# EAGLE schematic LM117_LDO_module (EAGLE 9.6.2)
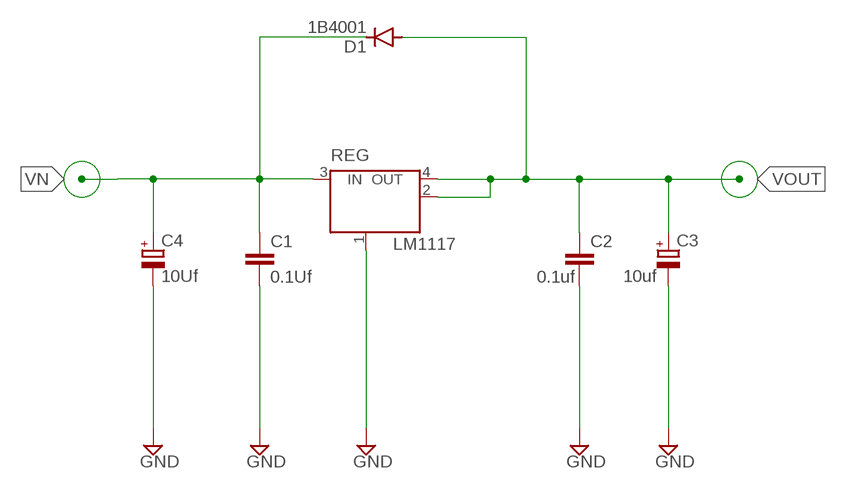
[diagram p0: schematic, sheet 1]

## Parts
C1  0.1Uf  C-EUC1206  [C1206]
C2  0.1uf  C-EUC1206  [C1206]
C3  10uf  CPOL-EUCT3216  [CT3216]
C4  10Uf  CPOL-EUCT3216  [CT3216]
D1  1B4001  DIODE-DO-214AC  [DO-214AC]
REG  LM1117  MC33269ST-3.3T3  [SOT223]

## Nets
GND: C1.2 C2.2 C3.- C4.- REG.1(GND/ADJ)
VN: C1.1 C4.+ D1.C REG.3(IN)
VOUT: C2.1 C3.+ D1.A REG.2(OUT) REG.4(OUT)

## Library data of the parts
C1 C2 = rcl:C-EU: CAPACITOR, European symbol; SPICEPREFIX: C
C3 C4 = rcl:CPOL-EU: POLARIZED CAPACITOR, European symbol; SPICEPREFIX: C
D1 = diode:DIODE-: DIODE
REG = linear:MC33269ST*: Adjustable Output Low Dropout Voltage Regulator 800 mA Source: http://www.onsemi.com/pub/Collateral/MC33269-D.PDF